# EAGLE design mcuModule (EAGLE 7.1.0)
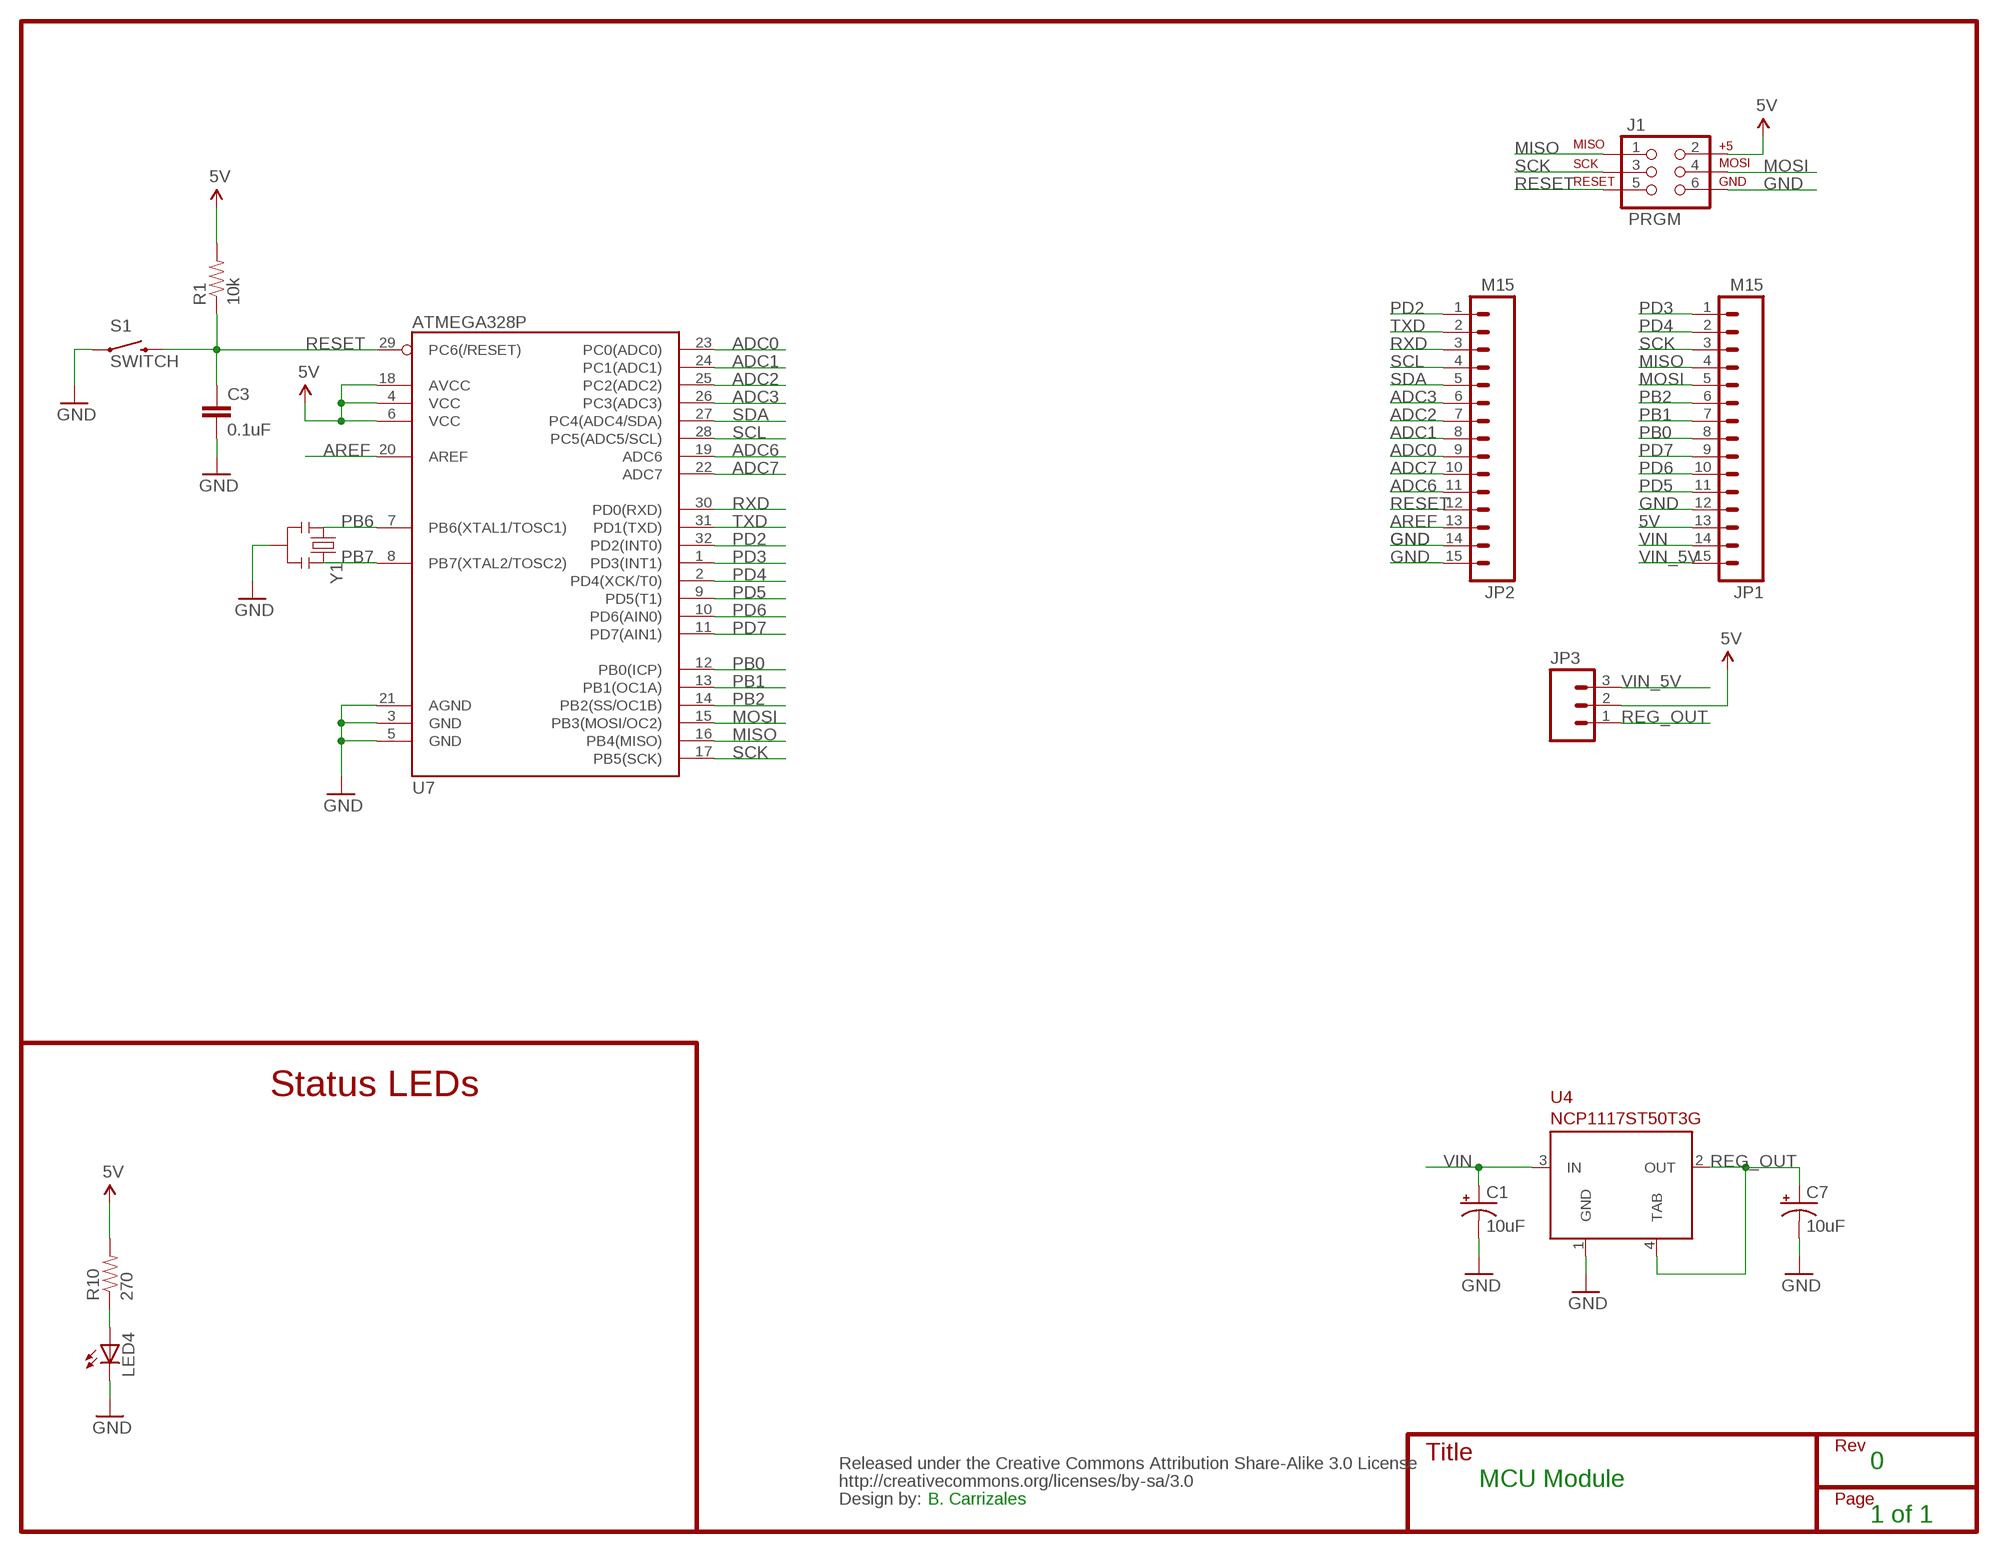
[diagram p0: schematic, sheet 1]

## Parts
C1  10uF  CAP_POL_AL  [PANASONIC_BMIN]
C3  0.1uF  CAP0603-CAP  [0603-CAP]
C7  10uF  CAP_POL_AL  [PANASONIC_BMIN]
CC_TEXT1  CREATIVE_COMMONS  [CREATIVE_COMMONS]
J1  PRGM  AVR_SPI_PRG_6PTH  [2X3]
JP1  M15  [1X15]
JP2  M15  [1X15]
JP3  M03PTH  [1X03]
LED4  LED0603  [LED-0603]
R1  10k  RESISTOR0603-RES  [0603-RES]
R10  270  RESISTOR0603-RES  [0603-RES]
S1  SWITCH  SWITCH-MOMENTARY-2SMD  [TACTILE_SWITCH_SMD]
U4  NCP1117ST50T3G  [SOT223]
U7  ATMEGA328P  ATMEGA328_SMT  [TQFP32-08]
Y1  RESONATORPTH  [RESONATOR-PTH]

## Nets
5V: J1.2 JP1.13 JP3.2 R1.2 R10.2 U7.4(VCC) U7.6(VCC) U7.18(AVCC)
ADC0: JP2.9 U7.23(PC0(ADC0))
ADC1: JP2.8 U7.24(PC1(ADC1))
ADC2: JP2.7 U7.25(PC2(ADC2))
ADC3: JP2.6 U7.26(PC3(ADC3))
ADC6: JP2.11 U7.19(ADC6)
ADC7: JP2.10 U7.22(ADC7)
AREF: JP2.13 U7.20(AREF)
GND: C1.- C3.2 C7.- J1.6 JP1.12 JP2.14 JP2.15 LED4.C S1.1 U4.1(GND) U7.3(GND) U7.5(GND) U7.21(AGND) Y1.2
MISO: J1.1 JP1.4 U7.16(PB4(MISO))
MOSI: J1.4 JP1.5 U7.15(PB3(MOSI/OC2))
N$19: LED4.A R10.1
PB0: JP1.8 U7.12(PB0(ICP))
PB1: JP1.7 U7.13(PB1(OC1A))
PB2: JP1.6 U7.14(PB2(SS/OC1B))
PB6: U7.7(PB6(XTAL1/TOSC1)) Y1.1
PB7: U7.8(PB7(XTAL2/TOSC2)) Y1.3
PD2: JP2.1 U7.32(PD2(INT0))
PD3: JP1.1 U7.1(PD3(INT1))
PD4: JP1.2 U7.2(PD4(XCK/T0))
PD5: JP1.11 U7.9(PD5(T1))
PD6: JP1.10 U7.10(PD6(AIN0))
PD7: JP1.9 U7.11(PD7(AIN1))
REG_OUT: C7.+ JP3.1 U4.2(OUT) U4.4(TAB)
RESET: C3.1 J1.5 JP2.12 R1.1 S1.3 U7.29(PC6(/RESET))
RXD: JP2.3 U7.30(PD0(RXD))
SCK: J1.3 JP1.3 U7.17(PB5(SCK))
SCL: JP2.4 U7.28(PC5(ADC5/SCL))
SDA: JP2.5 U7.27(PC4(ADC4/SDA))
TXD: JP2.2 U7.31(PD1(TXD))
VIN: C1.+ JP1.14 U4.3(IN)
VIN_5V: JP1.15 JP3.3

## Notes on the sheet
- Status LEDs
- 0
- MCU Module
- B. Carrizales
- 1 of 1

## Library data of the parts
C1 C7 = Passives:CAP_POL_AL: Panasonic Aluminum Electrolytic Capacitor Package B
C3 = SparkFun-Capacitors:CAP: Capacitor Standard 0603 ceramic capacitor, and 0.1" leaded capacitor.
CC_TEXT1 = SparkFun-Aesthetics:CREATIVE_COMMONS: Creative Commons License summary
J1 = SparkFun-Connectors:AVR_SPI_PRG_6: AVR ISP 6 Pin This is the reduced ISP connector for AVR programming. Common on Arduino. This footprint will take up less PCB space and can be used with a 10-pin to 6-pin adapter such as SKU: BOB-08508
JP1 JP2 = SparkFun-Connectors:M15: Header 15 Standard 15-pin 0.1" header. Use with straight break away headers (SKU : PRT-00116), right angle break away headers (PRT-00553), swiss pins (PRT-00743), machine pins (PRT-00117), and female headers (PRT-00115).
JP3 = SparkFun-Connectors:M03: Header 3 Standard 3-pin 0.1" header. Use with straight break away headers (SKU : PRT-00116), right angle break away headers (PRT-00553), swiss pins (PRT-00743), machine pins (PRT-00117), and female headers (PRT-00115). Molex polarized connector foot print use with SKU : PRT-08232 with associated crimp pins and housings.
LED4 = SparkFun-LED:LED: LEDs Standard schematic elements and footprints for 5mm, 3mm, 1206, and 0603 sized LEDs. 5mm - Spark Fun Electronics SKU : COM-00529 (and others)
R1 R10 = SparkFun-Passives:RESISTOR: Resistor Basic schematic elements and footprints for 0603, 1206, and PTH resistors.
S1 = SparkFun-Electromechanical:SWITCH-MOMENTARY-2: Various NO switches- pushbuttons, reed, etc; PROD_ID: SWCH-08247
U4 = regulators:NCP1117ST50T3G: NCP1117 5V, 1.0 A Low-Dropout Positive Fixed and Adjustable Voltage Regulator Datasheet <http://www.onsemi.com/pub_link/Collateral/NCP1117-D.PDF>; DIGIKEYPART#: NCP1117ST50T3GOSCT-ND
U7 = SparkFun-DigitalIC:ATMEGA328_SMT: 32-Pin Atmega328 part Commonly used on Arduino compatible boards Available in QFP and QFN packages TQFP is IC-09069 QFN is non-stock; PROD_ID: IC-09069
Y1 = SparkFun-FreqCtrl:RESONATOR: Resonator Small SMD resonator. Used, eg, on the Arduino Pro/ Pro Mini boards. 8MHz- XTAL-08895 16MHz- XTAL-08900

## Board
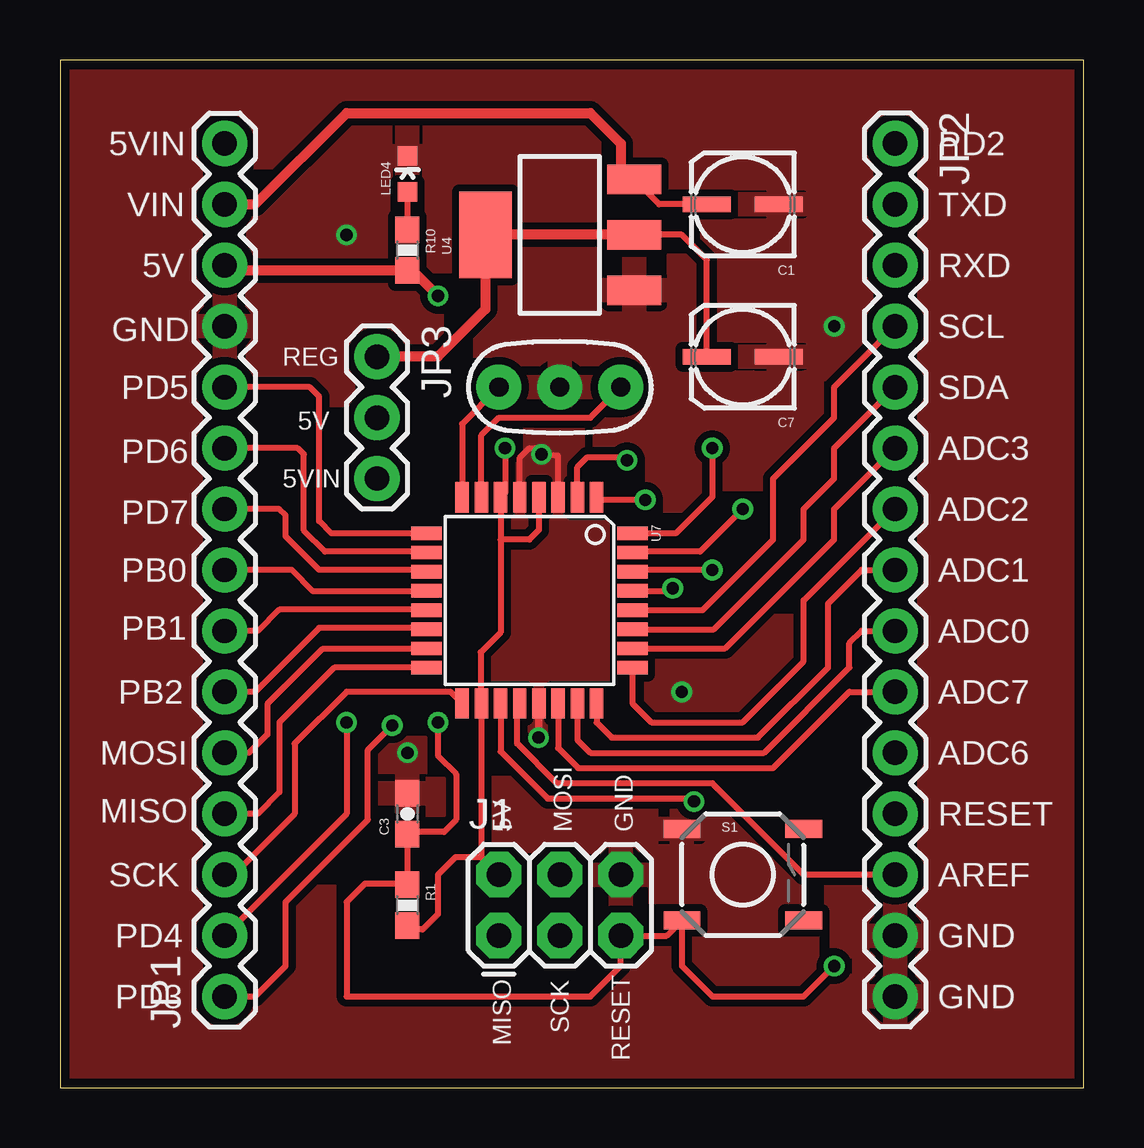
[diagram p1: board, top side]
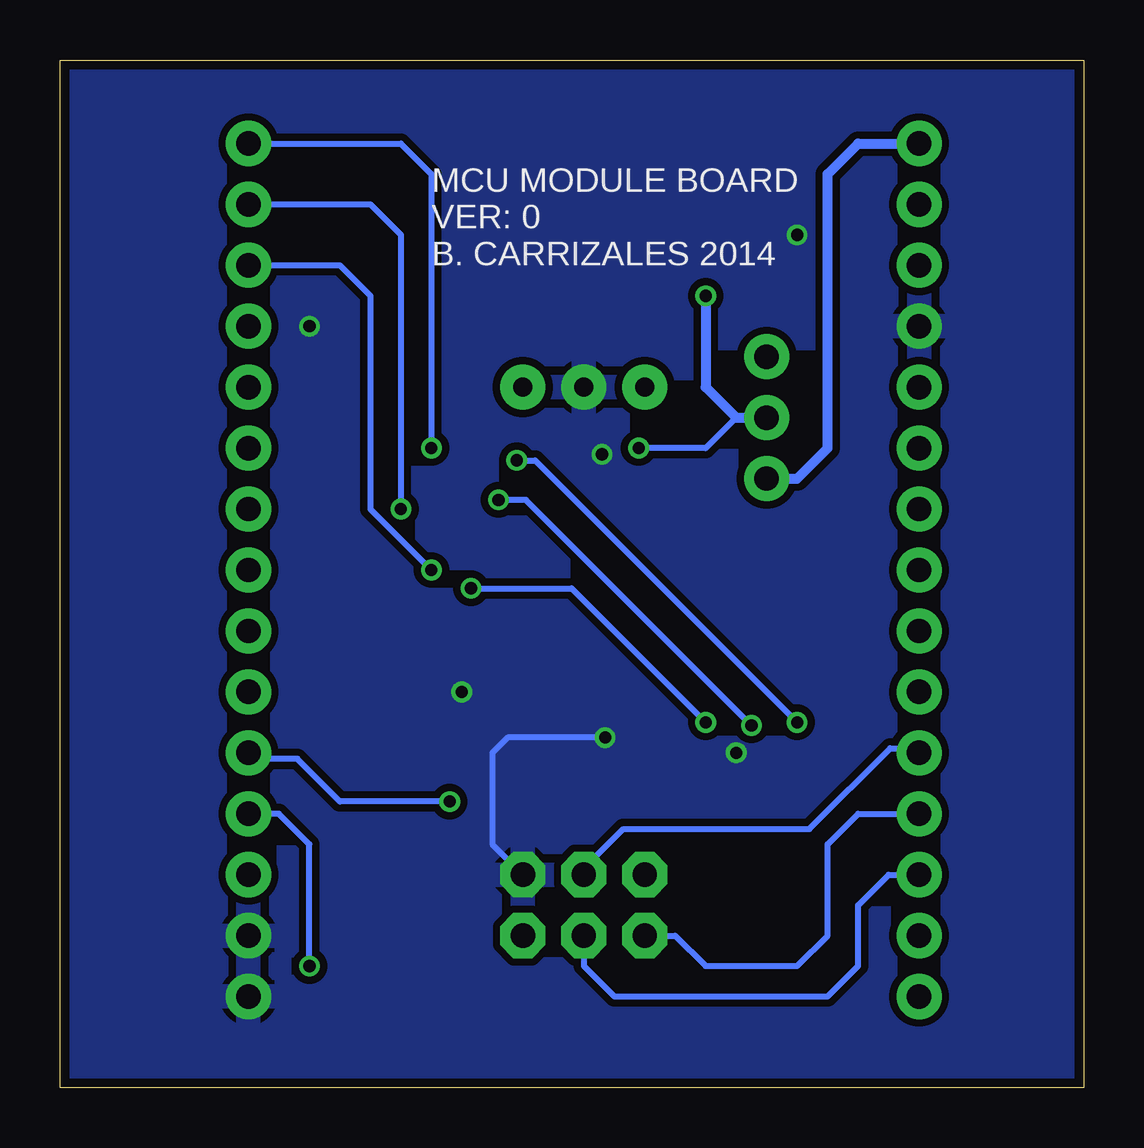
[diagram p2: board, bottom side, seen from below]

Size 42.65 x 42.85 mm. Coordinates in mm from the lower left corner, seen from the top.
Outline: 0,0 42.65,0 42.65,42.85 0,42.85 0,0
Copper layers (1*16): Top 0.0356mm / dielectric 1.5011mm / Bottom 0.0356mm
Design rules "LaenPCBOrder": minimum track width 6mil, minimum drill 13mil, track to track 6mil, track to pad 6mil, pad to pad 6mil, via to via 6mil, smd to smd 6mil, copper to edge 15mil, drill to drill 6mil, minimum pad ring 7mil, minimum via ring 7mil, stop-mask expansion 3mil, vias tented up to drill 0mil, thermal gap 10mil

### Footprints (pad centres in the part's own frame; a part is rotated, then mirrored left to right if it is on the bottom)
PANASONIC_BMIN = smd 2 x 0.65: + 1.5,0; - -1.5,0
0603-CAP = smd 1.1 x 1: 1 -0.85,0; 2 0.85,0
2X3 = drill 1.016 pad 1.88 octagon: 1 0,0; 2 0,2.54; 3 2.54,0; 4 2.54,2.54; 5 5.08,0; 6 5.08,2.54
1X15 = drill 1.016 pad 1.88: 1 0,0; 2 2.54,0; 3 5.08,0; 4 7.62,0; 5 10.16,0; 6 12.7,0; 7 15.24,0; 8 17.78,0; 9 20.32,0; 10 22.86,0; 11 25.4,0; 12 27.94,0; 13 30.48,0; 14 33.02,0; 15 35.56,0
1X03 = drill 1.016 pad 1.88: 1 0,0; 2 2.54,0; 3 5.08,0
LED-0603 = smd 0.8 x 0.8: A 0,-0.75; C 0,0.75
0603-RES = smd 1.1 x 1: 1 -0.85,0; 2 0.85,0
TACTILE_SWITCH_SMD = smd 1.524 x 0.762: 1 -2.54,1.905; 2 2.54,1.905; 3 -2.54,-1.905; 4 2.54,-1.905
SOT223 = smd 1.219 x 2.235: 1 -2.311,-3.099; 2 0,-3.099; 3 2.311,-3.099 | smd 3.6 x 2.2: 4 0,3.099
TQFP32-08 = smd 1.27 x 0.559: 1 -4.293,2.8; 2 -4.293,2; 3 -4.293,1.2; 4 -4.293,0.4; 5 -4.293,-0.4; 6 -4.293,-1.2; 7 -4.293,-2; 8 -4.293,-2.8; 17 4.293,-2.8; 18 4.293,-2; 19 4.293,-1.2; 20 4.293,-0.4; 21 4.293,0.4; 22 4.293,1.2; 23 4.293,2; 24 4.293,2.8 | smd 0.559 x 1.27: 9 -2.8,-4.293; 10 -2,-4.293; 11 -1.2,-4.293; 12 -0.4,-4.293; 13 0.4,-4.293; 14 1.2,-4.293; 15 2,-4.293; 16 2.8,-4.293; 25 2.8,4.293; 26 2,4.293; 27 1.2,4.293; 28 0.4,4.293; 29 -0.4,4.293; 30 -1.2,4.293; 31 -2,4.293; 32 -2.8,4.293
RESONATOR-PTH = drill 0.8 pad 1.88: 1 -2.54,0; 2 0,0; 3 2.54,0

### Placement (x,y rotation side)
C1  28.45,36.83 180 top
C3  14.48,11.43 90 top
C7  28.45,30.48 180 top
CC_TEXT1  -77.47,15.24 0 top  (outside the outline)
J1  18.29,6.35 0 top
JP1  6.86,3.81 90 top
JP2  34.8,39.37 270 top
JP3  13.21,30.48 270 top
LED4  14.48,38.1 0 top
R1  14.48,7.62 270 top
R10  14.48,34.92 270 top
S1  28.45,8.89 0 top
U4  20.83,35.56 90 top
U7  19.56,20.32 270 top
Y1  20.83,29.21 180 top

### Tracks (layer width: path | path; a pad name or v marks a point on that pad's centre or on a via)
5V  (via drill 0.51)
  Top 0.254: 18.36,22.86 U7.6 18.54,24.8 v18.54,26.67 | 18.36,22.86 18.36,18.99 17.53,18.16 17.53,16.06 U7.18 17.56,9.62 | 17.56,9.62 J1.2 | 17.56,9.62 16.48,9.62 15.75,8.89 15.75,7.24 15.11,6.6 14.64,6.6 R1.2 | U7.4 19.96,23.26 19.56,22.86 18.36,22.86
  Top 0.406: JP1.13 7.07,34.08 R10.2 14.69,34.08 v15.75,33.02
  Bottom 0.254: 14.48,27.94 15.75,26.67 v18.54,26.67
  Bottom 0.406: v15.75,33.02 15.75,29.21 14.48,27.94 JP3.2
ADC0
  Top 0.254: U7.23 21.56,14.51 22.1,13.97 29.34,13.97 32.89,17.53 32.89,18.54 33.4,19.05 JP2.9
ADC1
  Top 0.254: U7.24 22.36,15.23 22.99,14.61 29.08,14.61 32,17.53 32,20.19 33.4,21.59 JP2.8
ADC2
  Top 0.254: U7.25 23.85,16.03 24.64,15.24 28.45,15.24 30.99,17.78 30.99,20.32 JP2.7
ADC3
  Top 0.254: U7.26 27.72,18.32 32.26,22.86 32.26,24.13 JP2.6
ADC6  (via drill 0.51)
  Top 0.254: U7.19 18.36,14.03 20.32,12.06 26.29,12.06 v26.42,11.94
  Bottom 0.254: v26.42,11.94 30.99,11.94 32.77,13.72 34.54,13.72 JP2.11
ADC7
  Top 0.254: U7.22 20.76,14.17 21.59,13.34 29.72,13.34 32.89,16.51 JP2.10
AREF
  Top 0.254: JP2.13 30.99,8.89 27.18,12.7 20.7,12.7 19.05,14.35 19.05,15.92 U7.20
GND  (via drill 0.51)
  Top 0.254: U7.3 20.76,26.35 v20.07,26.42 19.81,26.67 19.56,26.67 19.16,26.27 U7.5
  Top 0.305: U7.21 19.96,14.62 v19.94,14.61
  Bottom 0.254: v19.94,14.61 24,14.61 24.64,13.97 24.64,10.16 J1.6
  other vias: 25.91,16.51 32.26,31.75 14.48,13.97 11.94,35.56
  pour Top (isolate 0.305): 0,43.18 0,0 43.18,0 43.18,43.18
  pour Bottom (isolate 0.305): 0,43.18 0,0 43.18,0 43.18,43.18
MISO
  Top 0.254: U7.16 11.43,17.53 9.14,15.24 9.14,12.32 8.26,11.43 JP1.4
  Bottom 0.254: J1.1 17.02,6.35 15.75,5.08 11.94,5.08 10.67,6.35 10.67,10.16 9.4,11.43 JP1.4
MOSI
  Top 0.254: U7.15 15.23,18.29 10.92,18.29 8.64,16 8.64,14.73 7.87,13.97 JP1.5
  Bottom 0.254: J1.4 20.83,9.14 19.18,10.79 11.43,10.79 8.06,14.16 7.05,14.16 JP1.5
N$19
  Top 0.254: LED4.A R10.1
PB0
  Top 0.254: U7.12 15.25,20.7 10.54,20.7 9.65,21.59 JP1.8
PB1
  Top 0.254: U7.13 15.25,19.94 9.14,19.94 8.26,19.05 JP1.7
PB2
  Top 0.254: U7.14 15.21,19.18 10.79,19.18 8.13,16.51 JP1.6
PB6
  Top 0.254: U7.7 17.56,27.21 18.29,27.94 22.1,27.94 Y1.1
PB7
  Top 0.254: Y1.3 16.76,27.68 U7.8
PD2  (via drill 0.51)
  Top 0.254: v27.18,26.67 27.18,24.64 25.65,23.11 U7.32
  Bottom 0.254: JP2.1 28.45,39.37 27.18,38.1 v27.18,26.67
PD3  (via drill 0.51)
  Top 0.254: JP1.1 8.13,3.81 9.4,5.08 9.4,7.75 12.83,11.18 12.83,14.1 v13.84,15.11 | v24.38,24.51 22.46,24.51 U7.1
  Bottom 0.254: v13.84,15.11 23.24,24.51 v24.38,24.51
PD4  (via drill 0.51)
  Top 0.254: v23.62,26.16 23.5,26.29 21.97,26.29 21.56,25.88 U7.2 | v11.94,15.24 11.94,11.43 JP1.2
  Bottom 0.254: v23.62,26.16 22.86,26.16 v11.94,15.24
PD5
  Top 0.254: U7.9 11.3,23.11 10.79,23.62 10.79,28.83 10.41,29.21 JP1.11
PD6
  Top 0.254: U7.10 15.23,22.35 11.05,22.35 10.16,23.24 10.16,26.42 9.91,26.67 JP1.10
PD7
  Top 0.254: U7.11 15.2,21.59 10.79,21.59 9.4,22.99 9.4,23.88 9.14,24.13 JP1.9
REG_OUT
  Top 0.254: C7.+ 26.95,34.52 25.91,35.56 U4.2
  Top 0.406: U4.2 U4.4 17.73,32.46 15.75,30.48 JP3.1
RESET  (via drill 0.51)
  Top 0.254: U7.29 25.42,20.72 v25.53,20.83 | v15.75,15.24 15.75,13.84 16.51,13.08 16.51,11.18 16,10.67 14.57,10.67 C3.1 R1.1 14.44,8.51 12.7,8.51 11.94,7.75 11.94,3.81 22.1,3.81 23.37,5.08 J1.5 25.27,6.35 S1.3 25.91,5.08 27.18,3.81 30.99,3.81 v32.26,5.08
  Bottom 0.254: v25.53,20.83 21.34,20.83 v15.75,15.24 | v32.26,5.08 32.26,10.16 33.53,11.43 JP2.12
RXD  (via drill 0.51)
  Top 0.254: v27.18,21.59 23.92,21.59 U7.30
  Bottom 0.254: JP2.3 30.99,34.29 29.72,33.02 29.72,24.13 v27.18,21.59
SCK
  Top 0.254: U7.17 16.27,16.51 11.94,16.51 9.78,14.35 9.78,11.43 7.24,8.89 JP1.3
  Bottom 0.254: J1.3 20.83,5.08 19.56,3.81 10.67,3.81 9.4,5.08 9.4,7.62 8.13,8.89 JP1.3
SCL
  Top 0.254: U7.28 26.78,19.92 29.72,22.86 29.72,25.4 32.26,27.94 32.26,29.21 JP2.4
SDA
  Top 0.254: U7.27 27.25,19.12 30.99,22.86 30.99,24.13 32.26,25.4 32.26,26.67 JP2.5
TXD  (via drill 0.51)
  Top 0.254: v28.45,24.13 26.67,22.35 23.88,22.35 U7.31
  Bottom 0.254: JP2.2 29.72,36.83 28.45,35.56 v28.45,24.13
VIN
  Top 0.254: C1.+ 24.97,36.83 23.53,38.27
  Top 0.406: JP1.14 8.13,36.83 11.94,40.64 22.1,40.64 23.37,39.37 23.37,38.43 23.53,38.27 U4.3
VIN_5V
  Bottom 0.406: JP3.3 11.94,25.4 10.67,26.67 10.67,38.1 9.4,39.37 JP1.15

### Text on the board
tPlace: 5VIN | PD2 | VIN | TXD | 5V | RXD | GND | SCL | REG | PD5 | SDA | 5V | PD6 | ADC3 | 5VIN | ADC2 | PD7 | PB0 | ADC1 | PB1 | ADC0 | PB2 | ADC7 | MOSI | ADC6 | MISO | 5V | MOSI | GND | RESET | SCK | AREF | PD4 | GND | PD3 | GND | MISO | SCK | RESET
bPlace: MCU MODULE BOARD / VER: 0 / B. CARRIZALES 2014